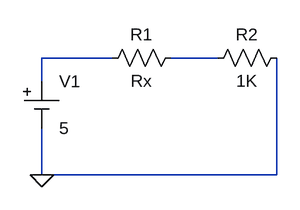
[diagram p0: schematic schema_ohmetro.asc]
schema_ohmetro.asc, the LTspice schematic file:
Version 4
SHEET 1 880 680
WIRE 64 64 -32 64
WIRE 208 64 144 64
WIRE -32 96 -32 64
WIRE -32 224 -32 160
WIRE 288 224 288 64
WIRE 288 224 -32 224
FLAG -32 224 0
SYMBOL Misc\\cell -32 96 R0
WINDOW 123 0 0 Left 0
WINDOW 39 0 0 Left 0
SYMATTR InstName V1
SYMATTR Value 5
SYMBOL res 160 48 R90
WINDOW 0 0 56 VBottom 2
WINDOW 3 32 56 VTop 2
SYMATTR InstName R1
SYMATTR Value Rx
SYMBOL res 304 48 R90
WINDOW 0 0 56 VBottom 2
WINDOW 3 32 56 VTop 2
SYMATTR InstName R2
SYMATTR Value 1K

The netlist it stands for:
* schema_ohmetro.asc
V1 N001 0 5
R1 N002 N001 Rx
R2 0 N002 1K
.backanno
.end